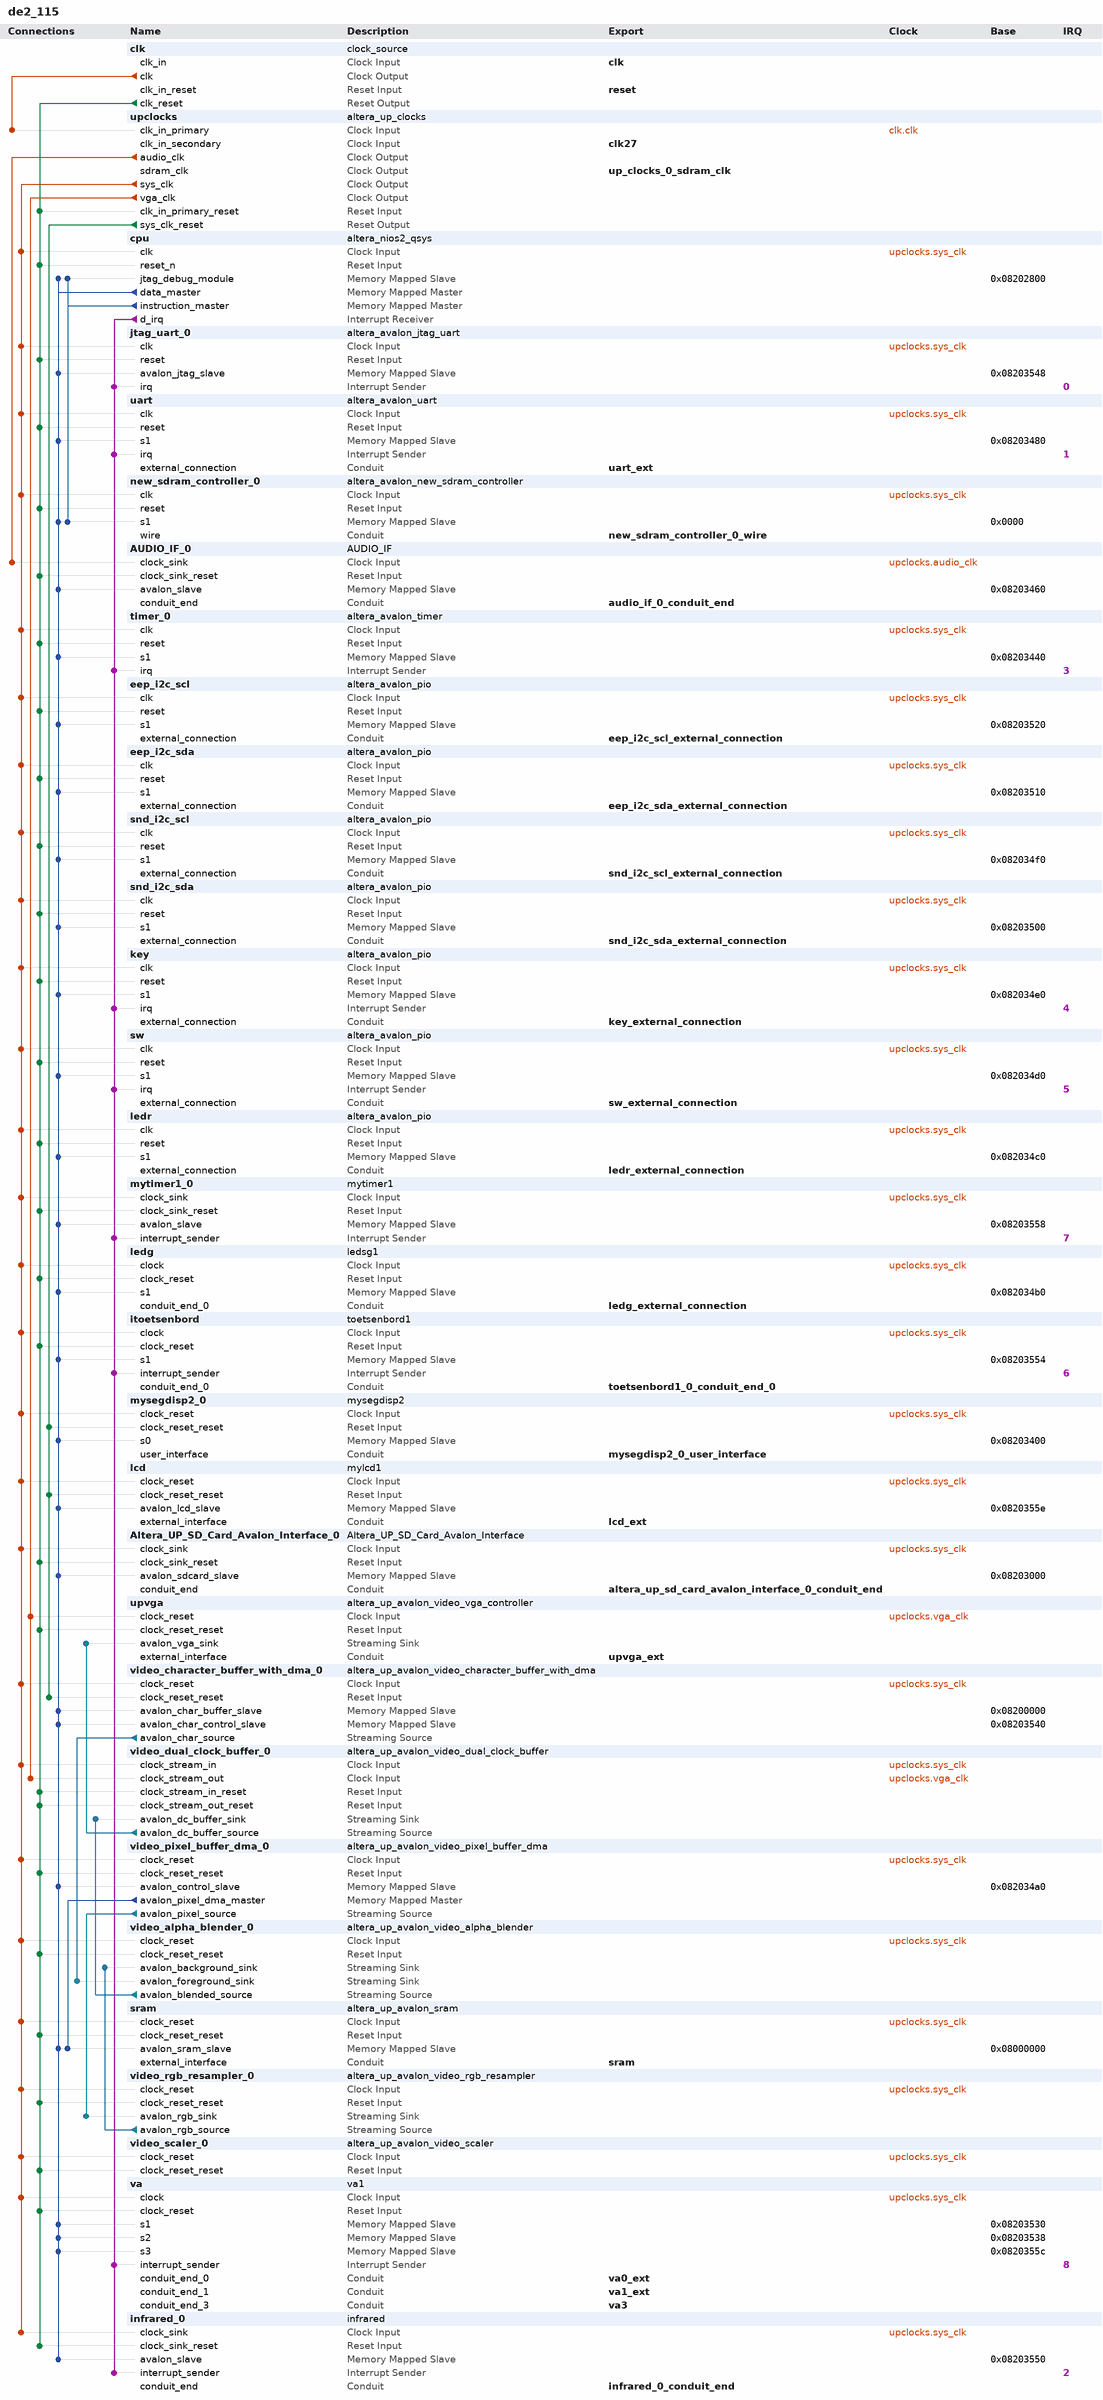
[diagram p0: system contents]
# Platform Designer (Qsys) system de2_115, Cyclone IV E EP4CE115F29C7
# Parameters at their usual value, and those the tool derives, are not listed.
package require -exact qsys 13.0
create_system de2_115
set_project_property DEVICE_FAMILY {Cyclone IV E}
set_project_property DEVICE EP4CE115F29C7

add_instance clk clock_source 13.0
set_instance_parameter_value clk clockFrequency 50000000

add_instance upclocks altera_up_clocks 13.0
set_instance_parameter_value upclocks board DE2-115
set_instance_parameter_value upclocks vga_clk true
set_instance_parameter_value upclocks audio_clk true
set_instance_parameter_value upclocks audio_clk_freq 11.2896

add_instance cpu altera_nios2_qsys 13.0
set_instance_parameter_value cpu resetSlave new_sdram_controller_0.s1
set_instance_parameter_value cpu mmu_TLBMissExcSlave None
set_instance_parameter_value cpu exceptionSlave new_sdram_controller_0.s1
set_instance_parameter_value cpu breakSlave cpu.jtag_debug_module
set_instance_parameter_value cpu impl Small
set_instance_parameter_value cpu icache_size 4096

add_instance jtag_uart_0 altera_avalon_jtag_uart 13.0.1.99.2
set_instance_parameter_value jtag_uart_0 simInteractiveOptions NO_INTERACTIVE_WINDOWS

add_instance uart altera_avalon_uart 13.0.1.99.2
set_instance_parameter_value uart baud 115200
set_instance_parameter_value uart dataBits 8
set_instance_parameter_value uart fixedBaud true
set_instance_parameter_value uart parity NONE
set_instance_parameter_value uart stopBits 1
set_instance_parameter_value uart useCtsRts true

add_instance new_sdram_controller_0 altera_avalon_new_sdram_controller 13.0.1.99.2
set_instance_parameter_value new_sdram_controller_0 TAC 5.5
set_instance_parameter_value new_sdram_controller_0 TRCD 20.0
set_instance_parameter_value new_sdram_controller_0 TRP 20.0
set_instance_parameter_value new_sdram_controller_0 casLatency 3
set_instance_parameter_value new_sdram_controller_0 columnWidth 10
set_instance_parameter_value new_sdram_controller_0 dataWidth 32
set_instance_parameter_value new_sdram_controller_0 generateSimulationModel false
set_instance_parameter_value new_sdram_controller_0 model single_Micron_MT48LC4M32B2_7_chip
set_instance_parameter_value new_sdram_controller_0 numberOfBanks 4
set_instance_parameter_value new_sdram_controller_0 numberOfChipSelects 1
set_instance_parameter_value new_sdram_controller_0 powerUpDelay 100.0
set_instance_parameter_value new_sdram_controller_0 refreshPeriod 15.625
set_instance_parameter_value new_sdram_controller_0 rowWidth 13

add_instance AUDIO_IF_0 AUDIO_IF 1.0

add_instance timer_0 altera_avalon_timer 13.0.1.99.2
set_instance_parameter_value timer_0 period 1
set_instance_parameter_value timer_0 periodUnits MSEC

add_instance eep_i2c_scl altera_avalon_pio 13.0.1.99.2
set_instance_parameter_value eep_i2c_scl direction Output
set_instance_parameter_value eep_i2c_scl width 1

add_instance eep_i2c_sda altera_avalon_pio 13.0.1.99.2
set_instance_parameter_value eep_i2c_sda direction Bidir
set_instance_parameter_value eep_i2c_sda width 1

add_instance snd_i2c_scl altera_avalon_pio 13.0.1.99.2
set_instance_parameter_value snd_i2c_scl direction Output
set_instance_parameter_value snd_i2c_scl width 1

add_instance snd_i2c_sda altera_avalon_pio 13.0.1.99.2
set_instance_parameter_value snd_i2c_sda direction Bidir
set_instance_parameter_value snd_i2c_sda width 1

add_instance key altera_avalon_pio 13.0.1.99.2
set_instance_parameter_value key captureEdge true
set_instance_parameter_value key direction Input
set_instance_parameter_value key edgeType FALLING
set_instance_parameter_value key generateIRQ true
set_instance_parameter_value key irqType EDGE
set_instance_parameter_value key width 3

add_instance sw altera_avalon_pio 13.0.1.99.2
set_instance_parameter_value sw captureEdge true
set_instance_parameter_value sw direction Input
set_instance_parameter_value sw edgeType FALLING
set_instance_parameter_value sw generateIRQ true
set_instance_parameter_value sw irqType EDGE
set_instance_parameter_value sw width 18

add_instance ledr altera_avalon_pio 13.0.1.99.2
set_instance_parameter_value ledr direction Output
set_instance_parameter_value ledr width 18

add_instance mytimer1_0 mytimer1 1.0

add_instance ledg ledsg1 1.0

add_instance itoetsenbord toetsenbord1 1.0

add_instance mysegdisp2_0 mysegdisp2 1.0
set_instance_parameter_value mysegdisp2_0 DATA_WIDTH 32
set_instance_parameter_value mysegdisp2_0 ENABLE_SYNC_SIGNALS 0
set_instance_parameter_value mysegdisp2_0 MODE_0 2

add_instance lcd mylcd1 13.0
set_instance_parameter_value lcd cursor Normal

add_instance Altera_UP_SD_Card_Avalon_Interface_0 Altera_UP_SD_Card_Avalon_Interface 13.0

add_instance upvga altera_up_avalon_video_vga_controller 13.0
set_instance_parameter_value upvga board DE2-115

add_instance video_character_buffer_with_dma_0 altera_up_avalon_video_character_buffer_with_dma 13.0
set_instance_parameter_value video_character_buffer_with_dma_0 enable_transparency true

add_instance video_dual_clock_buffer_0 altera_up_avalon_video_dual_clock_buffer 13.0
set_instance_parameter_value video_dual_clock_buffer_0 color_bits 10

add_instance video_pixel_buffer_dma_0 altera_up_avalon_video_pixel_buffer_dma 13.0
set_instance_parameter_value video_pixel_buffer_dma_0 addr_mode X-Y
set_instance_parameter_value video_pixel_buffer_dma_0 start_address 134217728
set_instance_parameter_value video_pixel_buffer_dma_0 back_start_address 134217728
set_instance_parameter_value video_pixel_buffer_dma_0 image_width 640
set_instance_parameter_value video_pixel_buffer_dma_0 image_height 480
set_instance_parameter_value video_pixel_buffer_dma_0 color_space {16-bit RGB}

add_instance video_alpha_blender_0 altera_up_avalon_video_alpha_blender 13.0

add_instance sram altera_up_avalon_sram 13.0
set_instance_parameter_value sram board DE2-115
set_instance_parameter_value sram pixel_buffer true

add_instance video_rgb_resampler_0 altera_up_avalon_video_rgb_resampler 13.0
set_instance_parameter_value video_rgb_resampler_0 input_type {16-bit RGB}
set_instance_parameter_value video_rgb_resampler_0 output_type {30-bit RGB}
set_instance_parameter_value video_rgb_resampler_0 alpha 1023

add_instance video_scaler_0 altera_up_avalon_video_scaler 13.0
set_instance_parameter_value video_scaler_0 width_scaling 0.5
set_instance_parameter_value video_scaler_0 height_scaling 1
set_instance_parameter_value video_scaler_0 width_in 640
set_instance_parameter_value video_scaler_0 height_in 480
set_instance_parameter_value video_scaler_0 color_bits 10
set_instance_parameter_value video_scaler_0 color_planes 3

add_instance va va1 1.0

add_instance infrared_0 infrared 1.0

# connections
add_connection clk.clk upclocks.clk_in_primary clock
add_connection upclocks.audio_clk AUDIO_IF_0.clock_sink clock
add_connection upclocks.sys_clk Altera_UP_SD_Card_Avalon_Interface_0.clock_sink clock
add_connection upclocks.sys_clk cpu.clk clock
add_connection upclocks.sys_clk eep_i2c_scl.clk clock
add_connection upclocks.sys_clk eep_i2c_sda.clk clock
add_connection upclocks.sys_clk infrared_0.clock_sink clock
add_connection upclocks.sys_clk itoetsenbord.clock clock
add_connection upclocks.sys_clk jtag_uart_0.clk clock
add_connection upclocks.sys_clk key.clk clock
add_connection upclocks.sys_clk lcd.clock_reset clock
add_connection upclocks.sys_clk ledg.clock clock
add_connection upclocks.sys_clk ledr.clk clock
add_connection upclocks.sys_clk mysegdisp2_0.clock_reset clock
add_connection upclocks.sys_clk mytimer1_0.clock_sink clock
add_connection upclocks.sys_clk new_sdram_controller_0.clk clock
add_connection upclocks.sys_clk snd_i2c_scl.clk clock
add_connection upclocks.sys_clk snd_i2c_sda.clk clock
add_connection upclocks.sys_clk sram.clock_reset clock
add_connection upclocks.sys_clk sw.clk clock
add_connection upclocks.sys_clk timer_0.clk clock
add_connection upclocks.sys_clk uart.clk clock
add_connection upclocks.sys_clk va.clock clock
add_connection upclocks.sys_clk video_alpha_blender_0.clock_reset clock
add_connection upclocks.sys_clk video_character_buffer_with_dma_0.clock_reset clock
add_connection upclocks.sys_clk video_dual_clock_buffer_0.clock_stream_in clock
add_connection upclocks.sys_clk video_pixel_buffer_dma_0.clock_reset clock
add_connection upclocks.sys_clk video_rgb_resampler_0.clock_reset clock
add_connection upclocks.sys_clk video_scaler_0.clock_reset clock
add_connection upclocks.vga_clk upvga.clock_reset clock
add_connection upclocks.vga_clk video_dual_clock_buffer_0.clock_stream_out clock
add_connection clk.clk_reset Altera_UP_SD_Card_Avalon_Interface_0.clock_sink_reset reset
add_connection clk.clk_reset AUDIO_IF_0.clock_sink_reset reset
add_connection clk.clk_reset cpu.reset_n reset
add_connection clk.clk_reset eep_i2c_scl.reset reset
add_connection clk.clk_reset eep_i2c_sda.reset reset
add_connection clk.clk_reset infrared_0.clock_sink_reset reset
add_connection clk.clk_reset itoetsenbord.clock_reset reset
add_connection clk.clk_reset jtag_uart_0.reset reset
add_connection clk.clk_reset key.reset reset
add_connection clk.clk_reset ledg.clock_reset reset
add_connection clk.clk_reset ledr.reset reset
add_connection clk.clk_reset mytimer1_0.clock_sink_reset reset
add_connection clk.clk_reset new_sdram_controller_0.reset reset
add_connection clk.clk_reset snd_i2c_scl.reset reset
add_connection clk.clk_reset snd_i2c_sda.reset reset
add_connection clk.clk_reset sram.clock_reset_reset reset
add_connection clk.clk_reset sw.reset reset
add_connection clk.clk_reset timer_0.reset reset
add_connection clk.clk_reset uart.reset reset
add_connection clk.clk_reset upclocks.clk_in_primary_reset reset
add_connection clk.clk_reset upvga.clock_reset_reset reset
add_connection clk.clk_reset va.clock_reset reset
add_connection clk.clk_reset video_alpha_blender_0.clock_reset_reset reset
add_connection clk.clk_reset video_dual_clock_buffer_0.clock_stream_in_reset reset
add_connection clk.clk_reset video_dual_clock_buffer_0.clock_stream_out_reset reset
add_connection clk.clk_reset video_pixel_buffer_dma_0.clock_reset_reset reset
add_connection clk.clk_reset video_rgb_resampler_0.clock_reset_reset reset
add_connection clk.clk_reset video_scaler_0.clock_reset_reset reset
add_connection upclocks.sys_clk_reset lcd.clock_reset_reset reset
add_connection upclocks.sys_clk_reset mysegdisp2_0.clock_reset_reset reset
add_connection upclocks.sys_clk_reset video_character_buffer_with_dma_0.clock_reset_reset reset
add_connection cpu.data_master Altera_UP_SD_Card_Avalon_Interface_0.avalon_sdcard_slave avalon
set_connection_parameter_value cpu.data_master/Altera_UP_SD_Card_Avalon_Interface_0.avalon_sdcard_slave baseAddress 0x08203000
add_connection cpu.data_master AUDIO_IF_0.avalon_slave avalon
set_connection_parameter_value cpu.data_master/AUDIO_IF_0.avalon_slave baseAddress 0x08203460
add_connection cpu.data_master cpu.jtag_debug_module avalon
set_connection_parameter_value cpu.data_master/cpu.jtag_debug_module baseAddress 0x08202800
add_connection cpu.data_master eep_i2c_scl.s1 avalon
set_connection_parameter_value cpu.data_master/eep_i2c_scl.s1 baseAddress 0x08203520
add_connection cpu.data_master eep_i2c_sda.s1 avalon
set_connection_parameter_value cpu.data_master/eep_i2c_sda.s1 baseAddress 0x08203510
add_connection cpu.data_master infrared_0.avalon_slave avalon
set_connection_parameter_value cpu.data_master/infrared_0.avalon_slave baseAddress 0x08203550
add_connection cpu.data_master itoetsenbord.s1 avalon
set_connection_parameter_value cpu.data_master/itoetsenbord.s1 baseAddress 0x08203554
add_connection cpu.data_master jtag_uart_0.avalon_jtag_slave avalon
set_connection_parameter_value cpu.data_master/jtag_uart_0.avalon_jtag_slave baseAddress 0x08203548
add_connection cpu.data_master key.s1 avalon
set_connection_parameter_value cpu.data_master/key.s1 baseAddress 0x082034e0
add_connection cpu.data_master lcd.avalon_lcd_slave avalon
set_connection_parameter_value cpu.data_master/lcd.avalon_lcd_slave baseAddress 0x0820355e
add_connection cpu.data_master ledg.s1 avalon
set_connection_parameter_value cpu.data_master/ledg.s1 baseAddress 0x082034b0
add_connection cpu.data_master ledr.s1 avalon
set_connection_parameter_value cpu.data_master/ledr.s1 baseAddress 0x082034c0
add_connection cpu.data_master mysegdisp2_0.s0 avalon
set_connection_parameter_value cpu.data_master/mysegdisp2_0.s0 baseAddress 0x08203400
add_connection cpu.data_master mytimer1_0.avalon_slave avalon
set_connection_parameter_value cpu.data_master/mytimer1_0.avalon_slave baseAddress 0x08203558
add_connection cpu.data_master new_sdram_controller_0.s1 avalon
set_connection_parameter_value cpu.data_master/new_sdram_controller_0.s1 baseAddress 0x0000
add_connection cpu.data_master snd_i2c_scl.s1 avalon
set_connection_parameter_value cpu.data_master/snd_i2c_scl.s1 baseAddress 0x082034f0
add_connection cpu.data_master snd_i2c_sda.s1 avalon
set_connection_parameter_value cpu.data_master/snd_i2c_sda.s1 baseAddress 0x08203500
add_connection cpu.data_master sram.avalon_sram_slave avalon
set_connection_parameter_value cpu.data_master/sram.avalon_sram_slave baseAddress 0x08000000
add_connection cpu.data_master sw.s1 avalon
set_connection_parameter_value cpu.data_master/sw.s1 baseAddress 0x082034d0
add_connection cpu.data_master timer_0.s1 avalon
set_connection_parameter_value cpu.data_master/timer_0.s1 baseAddress 0x08203440
add_connection cpu.data_master uart.s1 avalon
set_connection_parameter_value cpu.data_master/uart.s1 baseAddress 0x08203480
add_connection cpu.data_master va.s1 avalon
set_connection_parameter_value cpu.data_master/va.s1 baseAddress 0x08203530
add_connection cpu.data_master va.s2 avalon
set_connection_parameter_value cpu.data_master/va.s2 baseAddress 0x08203538
add_connection cpu.data_master va.s3 avalon
set_connection_parameter_value cpu.data_master/va.s3 baseAddress 0x0820355c
add_connection cpu.data_master video_character_buffer_with_dma_0.avalon_char_buffer_slave avalon
set_connection_parameter_value cpu.data_master/video_character_buffer_with_dma_0.avalon_char_buffer_slave baseAddress 0x08200000
add_connection cpu.data_master video_character_buffer_with_dma_0.avalon_char_control_slave avalon
set_connection_parameter_value cpu.data_master/video_character_buffer_with_dma_0.avalon_char_control_slave baseAddress 0x08203540
add_connection cpu.data_master video_pixel_buffer_dma_0.avalon_control_slave avalon
set_connection_parameter_value cpu.data_master/video_pixel_buffer_dma_0.avalon_control_slave baseAddress 0x082034a0
add_connection cpu.instruction_master cpu.jtag_debug_module avalon
set_connection_parameter_value cpu.instruction_master/cpu.jtag_debug_module baseAddress 0x08202800
add_connection cpu.instruction_master new_sdram_controller_0.s1 avalon
set_connection_parameter_value cpu.instruction_master/new_sdram_controller_0.s1 baseAddress 0x0000
add_connection video_pixel_buffer_dma_0.avalon_pixel_dma_master sram.avalon_sram_slave avalon
set_connection_parameter_value video_pixel_buffer_dma_0.avalon_pixel_dma_master/sram.avalon_sram_slave baseAddress 0x08000000
add_connection video_alpha_blender_0.avalon_blended_source video_dual_clock_buffer_0.avalon_dc_buffer_sink avalon_streaming
add_connection video_character_buffer_with_dma_0.avalon_char_source video_alpha_blender_0.avalon_foreground_sink avalon_streaming
add_connection video_dual_clock_buffer_0.avalon_dc_buffer_source upvga.avalon_vga_sink avalon_streaming
add_connection video_pixel_buffer_dma_0.avalon_pixel_source video_rgb_resampler_0.avalon_rgb_sink avalon_streaming
add_connection video_rgb_resampler_0.avalon_rgb_source video_alpha_blender_0.avalon_background_sink avalon_streaming
add_connection cpu.d_irq infrared_0.interrupt_sender interrupt
set_connection_parameter_value cpu.d_irq/infrared_0.interrupt_sender irqNumber 2
add_connection cpu.d_irq itoetsenbord.interrupt_sender interrupt
set_connection_parameter_value cpu.d_irq/itoetsenbord.interrupt_sender irqNumber 6
add_connection cpu.d_irq jtag_uart_0.irq interrupt
set_connection_parameter_value cpu.d_irq/jtag_uart_0.irq irqNumber 0
add_connection cpu.d_irq key.irq interrupt
set_connection_parameter_value cpu.d_irq/key.irq irqNumber 4
add_connection cpu.d_irq mytimer1_0.interrupt_sender interrupt
set_connection_parameter_value cpu.d_irq/mytimer1_0.interrupt_sender irqNumber 7
add_connection cpu.d_irq sw.irq interrupt
set_connection_parameter_value cpu.d_irq/sw.irq irqNumber 5
add_connection cpu.d_irq timer_0.irq interrupt
set_connection_parameter_value cpu.d_irq/timer_0.irq irqNumber 3
add_connection cpu.d_irq uart.irq interrupt
set_connection_parameter_value cpu.d_irq/uart.irq irqNumber 1
add_connection cpu.d_irq va.interrupt_sender interrupt
set_connection_parameter_value cpu.d_irq/va.interrupt_sender irqNumber 8

# exported interfaces
add_interface uart_ext conduit end
set_interface_property uart_ext EXPORT_OF uart.external_connection
add_interface new_sdram_controller_0_wire conduit end
set_interface_property new_sdram_controller_0_wire EXPORT_OF new_sdram_controller_0.wire
add_interface up_clocks_0_sdram_clk clock source
set_interface_property up_clocks_0_sdram_clk EXPORT_OF upclocks.sdram_clk
add_interface audio_if_0_conduit_end conduit end
set_interface_property audio_if_0_conduit_end EXPORT_OF AUDIO_IF_0.conduit_end
add_interface eep_i2c_scl_external_connection conduit end
set_interface_property eep_i2c_scl_external_connection EXPORT_OF eep_i2c_scl.external_connection
add_interface eep_i2c_sda_external_connection conduit end
set_interface_property eep_i2c_sda_external_connection EXPORT_OF eep_i2c_sda.external_connection
add_interface clk27 clock sink
set_interface_property clk27 EXPORT_OF upclocks.clk_in_secondary
add_interface reset reset sink
set_interface_property reset EXPORT_OF clk.clk_in_reset
add_interface clk clock sink
set_interface_property clk EXPORT_OF clk.clk_in
add_interface snd_i2c_scl_external_connection conduit end
set_interface_property snd_i2c_scl_external_connection EXPORT_OF snd_i2c_scl.external_connection
add_interface snd_i2c_sda_external_connection conduit end
set_interface_property snd_i2c_sda_external_connection EXPORT_OF snd_i2c_sda.external_connection
add_interface key_external_connection conduit end
set_interface_property key_external_connection EXPORT_OF key.external_connection
add_interface sw_external_connection conduit end
set_interface_property sw_external_connection EXPORT_OF sw.external_connection
add_interface ledr_external_connection conduit end
set_interface_property ledr_external_connection EXPORT_OF ledr.external_connection
add_interface ledg_external_connection conduit end
set_interface_property ledg_external_connection EXPORT_OF ledg.conduit_end_0
add_interface toetsenbord1_0_conduit_end_0 conduit end
set_interface_property toetsenbord1_0_conduit_end_0 EXPORT_OF itoetsenbord.conduit_end_0
add_interface mysegdisp2_0_user_interface conduit end
set_interface_property mysegdisp2_0_user_interface EXPORT_OF mysegdisp2_0.user_interface
add_interface lcd_ext conduit end
set_interface_property lcd_ext EXPORT_OF lcd.external_interface
add_interface upvga_ext conduit end
set_interface_property upvga_ext EXPORT_OF upvga.external_interface
add_interface altera_up_sd_card_avalon_interface_0_conduit_end conduit end
set_interface_property altera_up_sd_card_avalon_interface_0_conduit_end EXPORT_OF Altera_UP_SD_Card_Avalon_Interface_0.conduit_end
add_interface sram conduit end
set_interface_property sram EXPORT_OF sram.external_interface
add_interface va0_ext conduit end
set_interface_property va0_ext EXPORT_OF va.conduit_end_0
add_interface va1_ext conduit end
set_interface_property va1_ext EXPORT_OF va.conduit_end_1
add_interface va3 conduit end
set_interface_property va3 EXPORT_OF va.conduit_end_3
add_interface infrared_0_conduit_end conduit end
set_interface_property infrared_0_conduit_end EXPORT_OF infrared_0.conduit_end

set_interconnect_requirement {$system} qsys_mm.clockCrossingAdapter HANDSHAKE
set_interconnect_requirement {$system} qsys_mm.maxAdditionalLatency 1

save_system de2_115.qsys
